# Altium schematic sheet DIB_Power_Plane.SchDoc
size A4
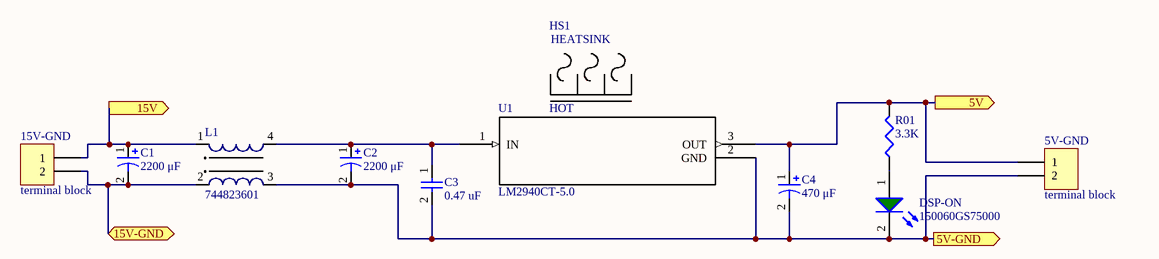
[diagram p0: DIB_Power_Plane.SchDoc]

## Parts
5V-GND  terminal block  [691101710002]
15V-GND  terminal block  [691101710002]
C1  2200 μF  [WCAP-ATG5 16x35.5x7.5x0.8]
C2  2200 μF  [WCAP-ATG5 16x35.5x7.5x0.8]
C3  0.47 uF  [WCAP-FTXX 7,5x10x12x6]
C4  470 μF  [WCAP-ATG8 8x11.5x3.5x0.5]
DSP-ON  150060GS75000  [LED_0603_Green]
HS1  HOT  [AAVID53002B02500G-custom]
L1  744823601  [WE-CMB_M_744823601]
R01  3.3K  [J1-0603]
U1  LM2940CT-5.0  [to220-123-v]

## Ports
5V (out), 5V-GND (out), 15V (out), 15V-GND

## Nets
5V: 5V-GND.1 C4.1 R01.2 U1.3(OUT) ; port 5V
5V-GND: 5V-GND.2 C2.2 C3.2 C4.2 DSP-ON.2(C) L1.3 U1.2(GND) ; port 5V-GND
15V: 15V-GND.1 C1.1 L1.1 ; port 15V
15V-GND: 15V-GND.2 C1.2 L1.2 ; port 15V-GND
NetC2_1: C2.1 C3.1 L1.4 U1.1(IN)
NetDSP-ON_1: DSP-ON.1(A) R01.1

## Notes on the sheet
- (in symbol TO-220 Heat Sink) HEATSINK

## Library data of the parts
5V-GND 15V-GND = 691101710002: WR-TBL Terminal block - serie 101-5.0mm; Manufacturer: Würth Elektronik eiSos GmbH; ComponentLink1 Description: Manufacturer; ComponentLink2 Description: Datasheet; NoPins: 2; Created Date: 30 October 2013; partNo: 691101710002; ComponentLink1URL: http://www.we-online.com; ComponentLink2URL: http://katalog.we-online.de/em/datasheet/6911017100xx.pdf; Created by: Karrer Zheng
C1 C2 = WCAP-ATG5 16x35.5x7.5x0.8 860020680030: WCAP-ATG5 Aluminum Electrolytic Capacitors , 2200 μF; + / - 20%; 50 V , 16 x 35,5; Manufacturer: Wurth Elektronik; E-mail: libraries@we-online.com; Characteristics: Aluminum Electrolytic Capacitor; Recommended soldering: Wave; Operating temperature:–40 °C to +105 °C for UR < 400 V; –25 °C to +105 °C for UR ≥ 400 V; General purpose product series with max. temperature of +105 °C; Load life: 2000 h @ +105 °C; ComponentLink1Description: Manufacturer; ComponentLink1URL: http://www.we-online.com; ComponentLink2Description: Datasheet; ComponentLink2URL: http://katalog.we-online.de/pbs/datasheet/860020680030.pdf; Created by: Karrer Zheng; Created Date: 6/8/2015; Capacitance: 2200 μF; Application: Medium and high voltage type range from 160V-450V used as primary side input filter in power supply; Low voltage type used as energy storage or low frequency filtering in circuit, applied to general switching power supply, AC-DC converter, adapter, charger, TV, VCR, DC motor circuit filter, digital audio, digital cameras, digital video cameras, satellite receiver etc.; partNo: 860020680030
C3 = WCAP-FTXX 7,5x10x12x6 890334022017: WCAP-FTXX Film Capacitors, C=68000 pF; Manufacturer: Wurth Elektronik; E-mail: libraries@we-online.com; ComponentLink1Description: Manufacturer; ComponentLink1URL: http://www.we-online.com; ComponentLink2Description: Datasheet; ComponentLink2URL: http://katalog.we-online.de/pbs/datasheet/890334022017.pdf; Created by: Karrer Zheng; Created Date: 3/2/2015; Capacitance: 0.47 uF; partNo: 890334022017
C4 = WCAP-ATG8 8x11.5x3.5x0.5 860010474013: WCAP-ATG8 Aluminum Electrolytic Capacitors , 470 μF; + / - 20%; 25 V , 8 x 11,5; Manufacturer: Wurth Elektronik; E-mail: libraries@we-online.com; Characteristics: Aluminum Electrolytic Capacitor; Recommended soldering: Wave; Operating temperature:–40 °C to +85 °C for UR < 400 V; 25 °C to +85 °C for UR ≥ 400 V; Wide capacitance value range; Load life: 2000 h @ +85 °C; ComponentLink1Description: Manufacturer; ComponentLink1URL: http://www.we-online.com; ComponentLink2Description: Datasheet; ComponentLink2URL: http://katalog.we-online.de/pbs/datasheet/860010474013.pdf; Created by: Karrer Zheng; Created Date: 6/8/2015; Capacitance: 470 μF; Application: Medium and high voltage type range from 160V-450V used as primary side input filter in power supply; Low voltage type used as energy storage or low frequency filtering in circuit, applied to general switching power supply, AC-DC converter, adapter, charger, TV, VCR, DC motor circuit filter, digital audio, digital cameras, digital video cameras, satellite receiver etc.; partNo: 860010474013
DSP-ON = WL-SMCW 0603  150060GS75000: SMD mono-color Chip LED, WL-SMCW, Green; Manufacturer: W黵th Elektronik eiSos GmbH; PartNo: 150060GS75000; ComponentLink1Description: Manufacturer; ComponentLink1URL: http://www.we-online.de; Created by: Christin Otto; Created Date: June 2013; ComponentLink2Description: Datasheet; ComponentLink2URL: http://katalog.we-online.com/led/datasheet/150060GS75000.pdf; Color: Green
HS1 = TO-220 Heat Sink: TO 220 heat sink L=25mm; B=15mm; H= 30mm
L1 = WE-CMB M, 744823601: WE-CMB Common Mode Power Line Choke, L = 1.0mH; Manufacturer: Wurth Elektronik; partNo: 744823601; Inductance: 1.0mH; ComponentLink1Description: Manufacturer; ComponentLink1URL: http://www.we-online.de; Created by: Baojun Chen; Created Date: Feb.2016; ComponentLink2Description: Datasheet; ComponentLink2URL: http://katalog.we-online.de/pbs/datasheet/744823601.pdf
R01 = Res3: Resistor; Published: 8-Jun-2000; LatestRevisionDate: 29-May-2009; LatestRevisionNote: IPC-7351 Footprint Added.; PackageReference: J1-0603; Publisher: Altium Limited; PackageDescription: Chip Resistor; Value: 3.3K
U1 = LM2940C_NDE_3: Imported; PartNumber: LM2940CT-12; Comp: TypeLDO; Vendor: NationalSemiconductor; Symbol: NameLM2940CT-12; Library: ReferenceLM2940T; Type: DEV; Version: 1; base_pn: LM2940C; Pin: Count3; RefDes: RefDes; Value: Value